# EAGLE design lednode (EAGLE 6.5.0)
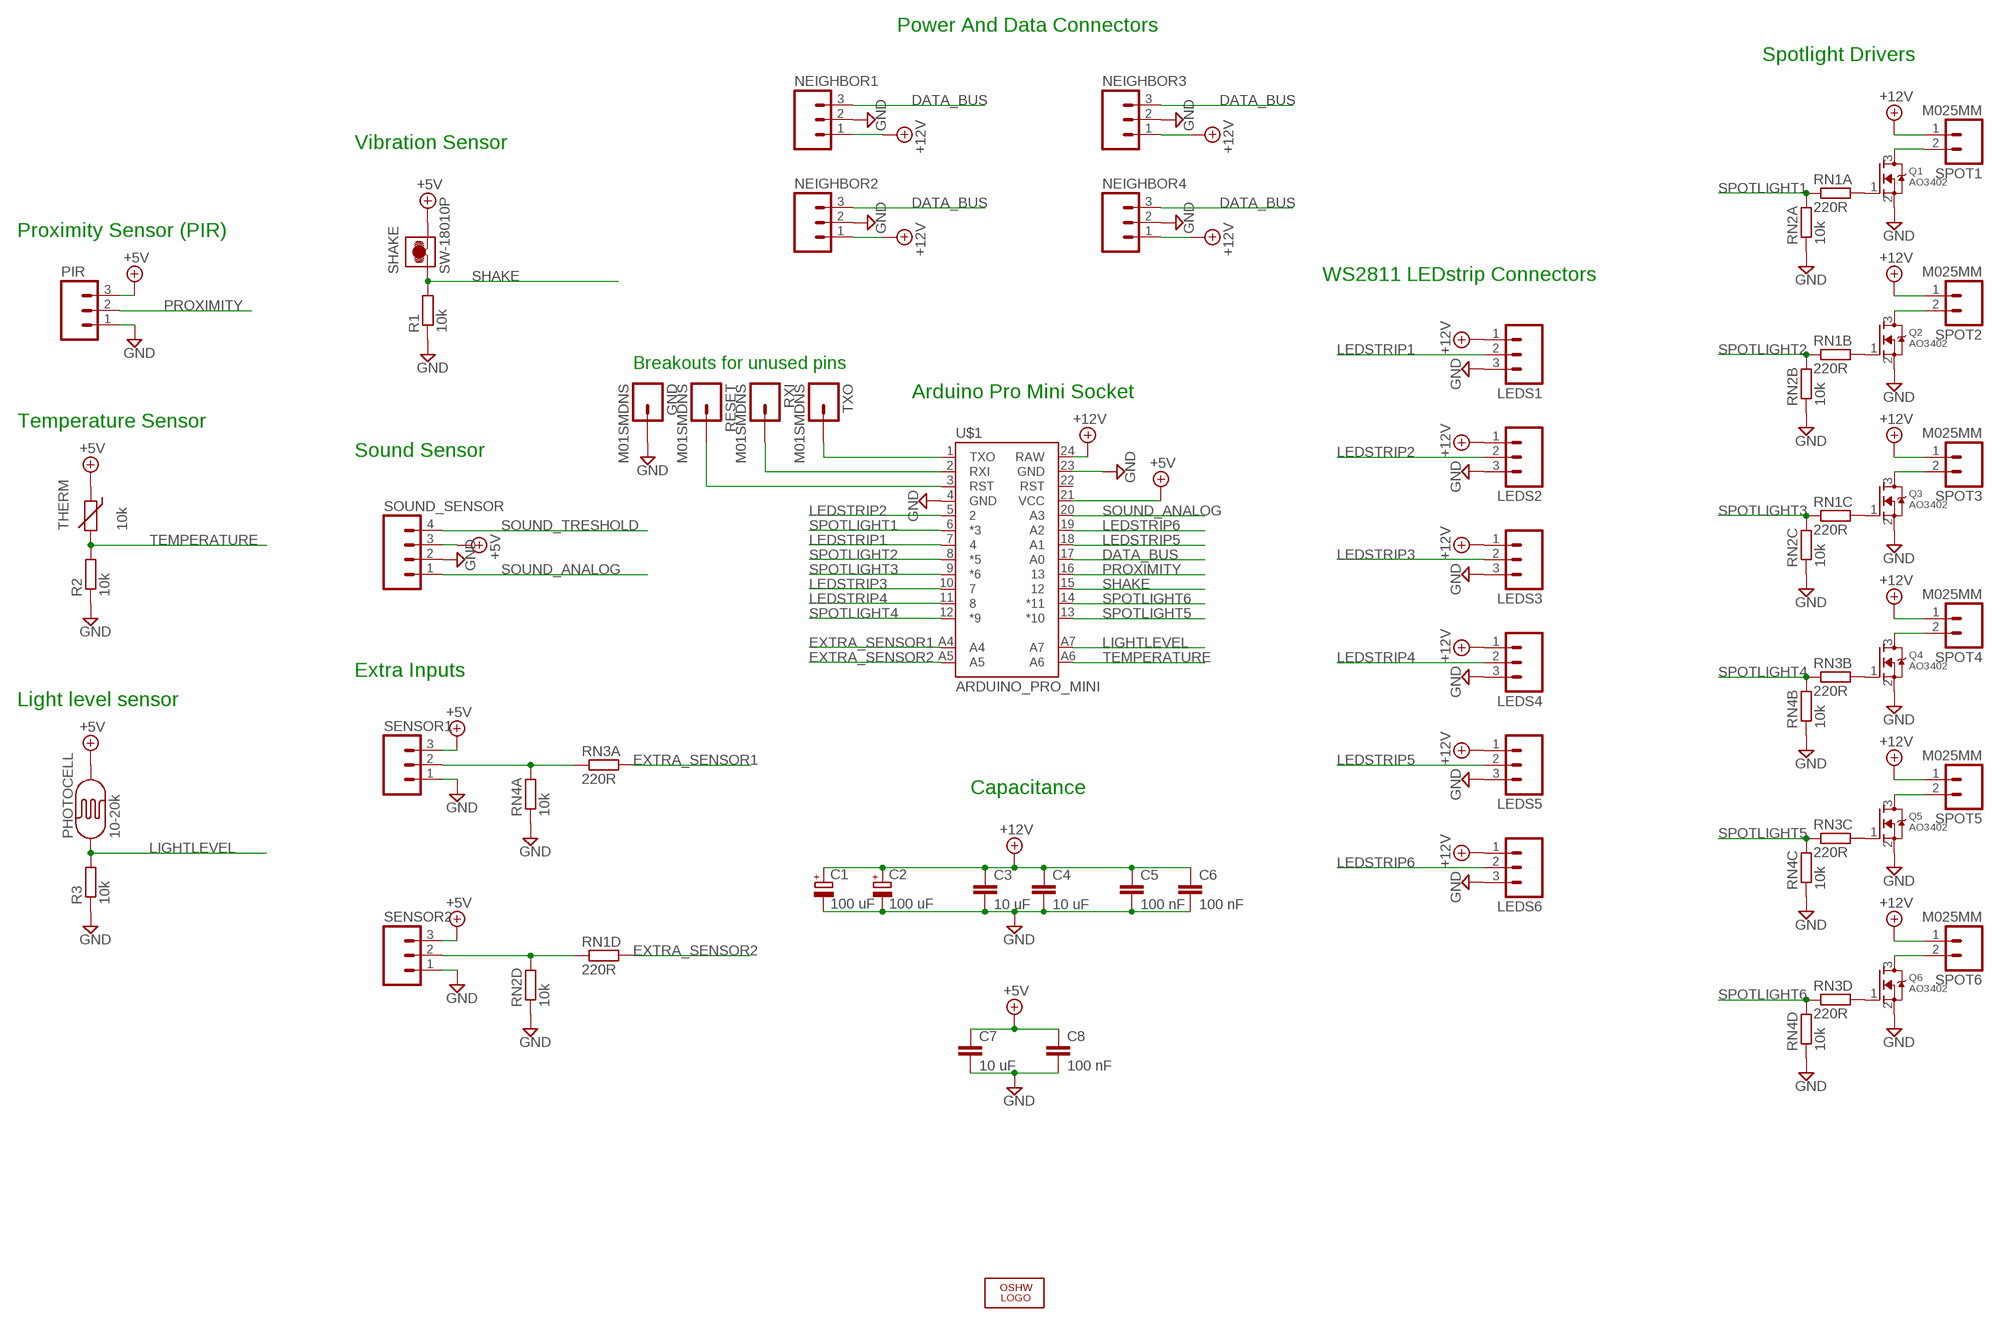
[diagram p0: schematic, sheet 1]

## Parts
C1  100 uF  CPOL-EUE3.5-10  [E3,5-10]
C2  100 uF  CPOL-EUE3.5-10  [E3,5-10]
C3  10 uF  C-EUC1206  [C1206]
C4  10 uF  C-EUC1206  [C1206]
C5  100 nF  C-EUC0805  [C0805]
C6  100 nF  C-EUC0805  [C0805]
C7  10 uF  C-EUC1206  [C1206]
C8  100 nF  C-EUC0805  [C0805]
GND  M01SMDNS  [1X01NS]
LEDS1  M03LONGPADS  [1X03_LONGPADS]
LEDS2  M03LONGPADS  [1X03_LONGPADS]
LEDS3  M03LONGPADS  [1X03_LONGPADS]
LEDS4  M03LONGPADS  [1X03_LONGPADS]
LEDS5  M03LONGPADS  [1X03_LONGPADS]
LEDS6  M03LONGPADS  [1X03_LONGPADS]
LOGO3  LOGO-OSHW-8MILX0100-NT  [OSHW_8X100_NOTEXT]
NEIGHBOR1  M03-SCREW-5MM  [SCREWTERMINAL-5MM-3]
NEIGHBOR2  M03-SCREW-5MM  [SCREWTERMINAL-5MM-3]
NEIGHBOR3  M03-SCREW-5MM  [SCREWTERMINAL-5MM-3]
NEIGHBOR4  M03-SCREW-5MM  [SCREWTERMINAL-5MM-3]
PHOTOCELL  10-20k  PHOTOCELLPTH  [PHOTOCELL]
PIR  M03PTH  [1X03]
Q1  AO3402  MOSFET-NWAVE  [SOT23-W]
Q2  AO3402  MOSFET-NWAVE  [SOT23-W]
Q3  AO3402  MOSFET-NWAVE  [SOT23-W]
Q4  AO3402  MOSFET-NWAVE  [SOT23-W]
Q5  AO3402  MOSFET-NWAVE  [SOT23-W]
Q6  AO3402  MOSFET-NWAVE  [SOT23-W]
R1  10k  R-EU_R0805  [R0805]
R2  10k  R-EU_R0805  [R0805]
R3  10k  R-EU_R0805  [R0805]
RESET  M01SMDNS  [1X01NS]
RN1  220R  RESISTOR_ARRAY_4  [RN8P-4R-CRA06S]
RN2  10k  RESISTOR_ARRAY_4  [RN8P-4R-CRA06S]
RN3  220R  RESISTOR_ARRAY_4  [RN8P-4R-CRA06S]
RN4  10k  RESISTOR_ARRAY_4  [RN8P-4R-CRA06S]
RXI  M01SMDNS  [1X01NS]
SENSOR1  M03PTH  [1X03]
SENSOR2  M03PTH  [1X03]
SHAKE  SW-18010P  CM4400  [CM4400]
SOUND_SENSOR  M041X04_NO_SILK  [1X04_NO_SILK]
SPOT1  M025MM  [SCREWTERMINAL-5MM-2]
SPOT2  M025MM  [SCREWTERMINAL-5MM-2]
SPOT3  M025MM  [SCREWTERMINAL-5MM-2]
SPOT4  M025MM  [SCREWTERMINAL-5MM-2]
SPOT5  M025MM  [SCREWTERMINAL-5MM-2]
SPOT6  M025MM  [SCREWTERMINAL-5MM-2]
THERM  10k  THERMISTOR_R-7,5  [R-7,5]
TXO  M01SMDNS  [1X01NS]
U$1  ARDUINO_PRO_MINI  [ARDUINO_PRO_MINI]

## Nets
+5V: C7.1 C8.1 PHOTOCELL.2 PIR.3 SENSOR1.3 SENSOR2.3 SHAKE.2 SOUND_SENSOR.3 THERM.1 U$1.21(VCC)
+12V: C1.+ C2.+ C3.1 C4.1 C5.1 C6.1 LEDS1.1 LEDS2.1 LEDS3.1 LEDS4.1 LEDS5.1 LEDS6.1 NEIGHBOR1.1 NEIGHBOR2.1 NEIGHBOR3.1 NEIGHBOR4.1 SPOT1.1 SPOT2.1 SPOT3.1 SPOT4.1 SPOT5.1 SPOT6.1 U$1.24(RAW)
DATA_BUS: NEIGHBOR1.3 NEIGHBOR2.3 NEIGHBOR3.3 NEIGHBOR4.3 U$1.17(A0)
EXTRA_SENSOR1: RN3.8 U$1.A4
EXTRA_SENSOR2: RN1.5 U$1.A5
GND: C1.- C2.- C3.2 C4.2 C5.2 C6.2 C7.2 C8.2 GND.1 LEDS1.3 LEDS2.3 LEDS3.3 LEDS4.3 LEDS5.3 LEDS6.3 NEIGHBOR1.2 NEIGHBOR2.2 NEIGHBOR3.2 NEIGHBOR4.2 PIR.1 Q1.2(S) Q2.2(S) Q3.2(S) Q4.2(S) Q5.2(S) Q6.2(S) R1.1 R2.1 R3.1 RN2.1 RN2.2 RN2.3 RN2.4 RN4.1 RN4.2 RN4.3 RN4.4 SENSOR1.1 SENSOR2.1 SOUND_SENSOR.2 U$1.4(GND) U$1.23(GND)
LEDSTRIP1: LEDS1.2 U$1.7
LEDSTRIP2: LEDS2.2 U$1.5
LEDSTRIP3: LEDS3.2 U$1.10
LEDSTRIP4: LEDS4.2 U$1.11
LEDSTRIP5: LEDS5.2 U$1.18(A1)
LEDSTRIP6: LEDS6.2 U$1.19(A2)
LIGHTLEVEL: PHOTOCELL.1 R3.2 U$1.A7
N$1: Q5.3(D) SPOT5.2
N$2: Q1.3(D) SPOT1.2
N$3: Q2.3(D) SPOT2.2
N$4: Q4.3(D) SPOT4.2
N$5: Q3.3(D) SPOT3.2
N$6: Q1.1(G) RN1.8
N$7: Q2.1(G) RN1.7
N$8: Q4.1(G) RN3.7
N$9: Q3.1(G) RN1.6
N$10: Q5.1(G) RN3.6
N$11: Q6.3(D) SPOT6.2
N$12: Q6.1(G) RN3.5
N$13: RN1.4 RN2.5 SENSOR2.2
N$14: TXO.1 U$1.1(TXO)
N$15: RXI.1 U$1.2(RXI)
N$16: RESET.1 U$1.3(RST)
PROXIMITY: PIR.2 U$1.16
SENSOR1: RN3.1 RN4.8 SENSOR1.2
SHAKE: R1.2 SHAKE.1 U$1.15
SOUND_ANALOG: SOUND_SENSOR.1 U$1.20(A3)
SOUND_TRESHOLD: SOUND_SENSOR.4
SPOTLIGHT1: RN1.1 RN2.8 U$1.6(*3)
SPOTLIGHT2: RN1.2 RN2.7 U$1.8(*5)
SPOTLIGHT3: RN1.3 RN2.6 U$1.9(*6)
SPOTLIGHT4: RN3.2 RN4.7 U$1.12(*9)
SPOTLIGHT5: RN3.3 RN4.6 U$1.13(*10)
SPOTLIGHT6: RN3.4 RN4.5 U$1.14(*11)
TEMPERATURE: R2.2 THERM.2 U$1.A6
Unconnected: U$1.22(RST)

## Notes on the sheet
- Power And Data Connectors
- Spotlight Drivers
- Vibration Sensor
- Proximity Sensor (PIR)
- WS2811 LEDstrip Connectors
- Breakouts for unused pins
- Arduino Pro Mini Socket
- Temperature Sensor
- Sound Sensor
- Extra Inputs
- Light level sensor
- Capacitance

## Library data of the parts
C1 C2 = rcl:CPOL-EU: POLARIZED CAPACITOR, European symbol
C3-C8 = rcl:C-EU: CAPACITOR, European symbol
GND RESET RXI TXO = SparkFun-Connectors:M01: Header 1 Standard 1-pin 0.1" header. Use with straight break away headers (SKU : PRT-00116), right angle break away headers (PRT-00553), swiss pins (PRT-00743), machine pins (PRT-00117), and female headers (PRT-00115).
LEDS1-LEDS6 NEIGHBOR1-NEIGHBOR4 PIR SENSOR1 SENSOR2 = SparkFun-Connectors:M03: Header 3 Standard 3-pin 0.1" header. Use with straight break away headers (SKU : PRT-00116), right angle break away headers (PRT-00553), swiss pins (PRT-00743), machine pins (PRT-00117), and female headers (PRT-00115). Molex polarized connector foot print use with SKU : PRT-08232 with associated crimp pins and housings.
LOGO3 = Logo:LOGO-OSHW-8MIL
PHOTOCELL = SparkFun-Sensors:PHOTOCELL: CdS photoresistor. This is a low cost way to detect light levels. Resistance decreases with more incoming light. SparkFun SKU: SEN-09088
Q1-Q6 = adafruit:MOSFET-N: N-Channel Mosfet 2N7002E - 60V 260mA SOT23 [Digikey: 2N7002ET1GOSTR-ND] - REEL BSH103 - 30V 850mA SOT23 [Digikey: 568-5013-1-ND]
R1-R3 = rcl:R-EU_: RESISTOR, European symbol
RN1-RN4 = dp_devices:RESISTOR_ARRAY_4: 4 Resistor Array 0603
SHAKE = sensor-comus-group:CM4400: MOVEMENT / VIBRATION SWITCH - Mercury Contacts Source: Assemtech Europe Limited, E. Bachem GmbH Comus International, W. Gunther GmbH, Gunther Belgium; MF: FARNELL; MPN: CM4400-1.; OC_FARNELL: 540626; OC_NEWARK: 09WX7014
SOUND_SENSOR = SparkFun-Connectors:M04: Header 4 Standard 4-pin 0.1" header. Use with straight break away headers (SKU : PRT-00116), right angle break away headers (PRT-00553), swiss pins (PRT-00743), machine pins (PRT-00117), and female headers (PRT-00115). Molex polarized connector foot print use with SKU : PRT-08231 with associated crimp pins and housings. 1MM SMD Version SKU: PRT-10208
SPOT1-SPOT6 = SparkFun-Connectors:M02: Standard 2-pin 0.1" header. Use with - straight break away headers ( PRT-00116) - right angle break away headers (PRT-00553) - swiss pins (PRT-00743) - machine pins (PRT-00117) - female headers (PRT-00115) Molex polarized connector foot print use with: PRT-08233 with associated crimp pins and housings. 2.54_SCREWTERM for use with PRT-10571. 3.5mm Screw Terminal footprints for PRT-08084 5mm Screw Terminal footprints for use with PRT-08433
THERM = discrete-fixed-thermistor-silk:THERMISTOR_: Thermo Resistor
U$1 = SparkFun-Boards-with-arduino-pro-mini-without-connection-pins:ARDUINO_PRO_MINI

## Board
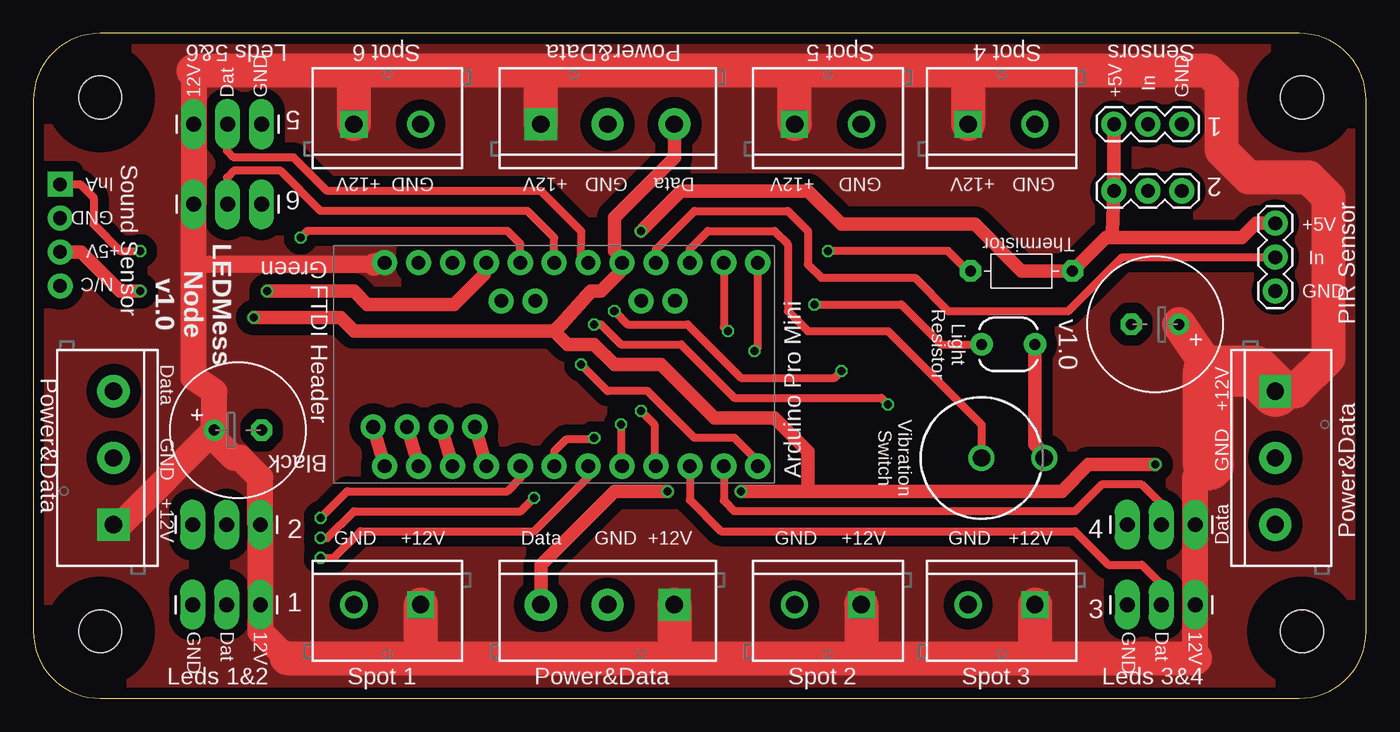
[diagram p1: board, top side]
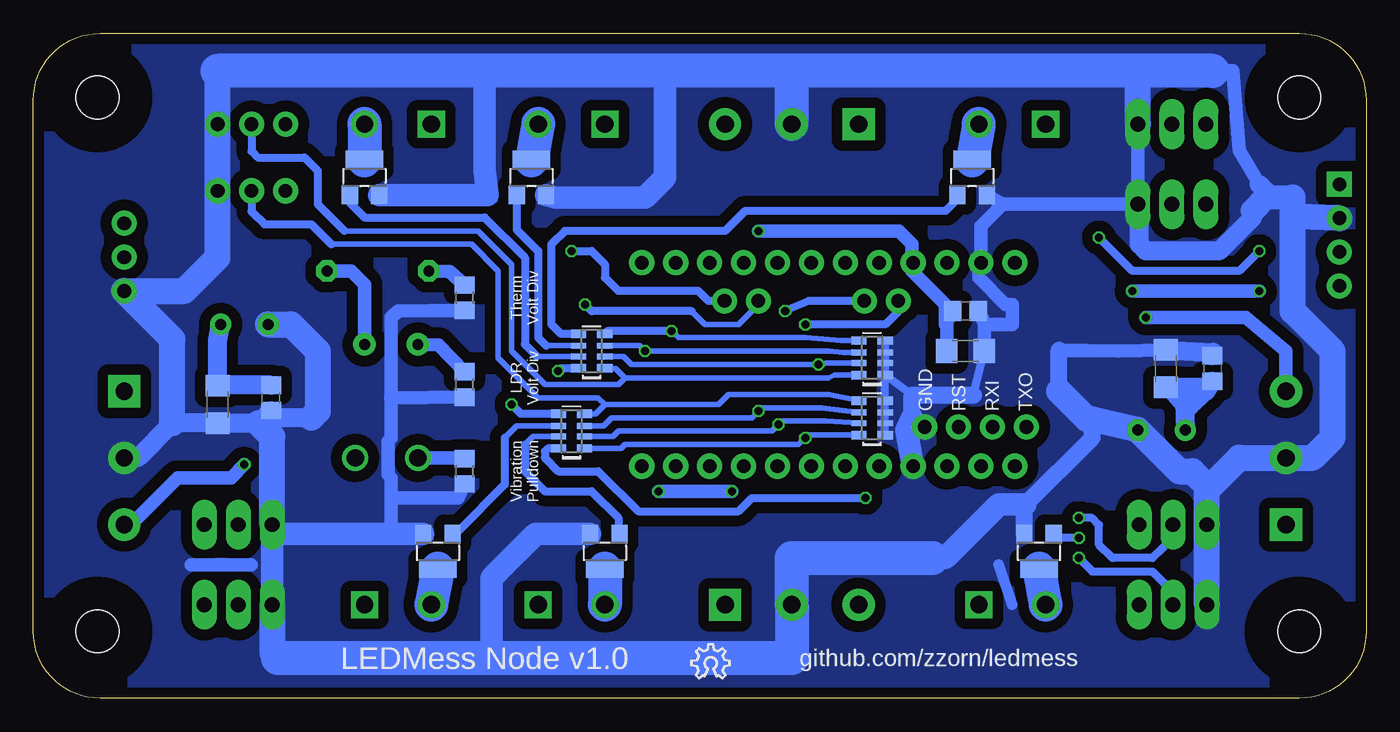
[diagram p2: board, bottom side, seen from below]

Size 99.8 x 49.8 mm. Coordinates in mm from the lower left corner, seen from the top.
Outline: 0,44.8 0,5 arc90 5,0 94.8,0 arc90 99.8,5 99.8,44.8 arc90 94.8,49.8 5,49.8 arc90 0,44.8
Copper layers (1*16): Top 0.035mm / dielectric 1.5mm / Bottom 0.035mm
Design rules "SeeedStudio_2layer_DRU_no_angle_20140221": minimum track width 6mil, minimum drill 12mil, track to track 6mil, track to pad 6mil, pad to pad 6mil, via to via 6mil, smd to smd 0mil, copper to edge 10mil, drill to drill 10mil, minimum pad ring 10mil, minimum via ring 6mil, stop-mask expansion 2mil, vias tented up to drill 100mil, thermal gap 10mil
Holes 3.2 mm at 95,5 95,45 5,45 5,5
tRestrict: area 3,3 to 7,7; area 93,3 to 97,7; area 93,43 to 97,47; area 3,43 to 7,47
bRestrict: area 3,3 to 7,7; area 93,3 to 97,7; area 93,43 to 97,47; area 3,43 to 7,47

### Footprints (pad centres in the part's own frame; a part is rotated, then mirrored left to right if it is on the bottom)
E3,5-10 = drill 0.813 pad 1.6: + -1.778,0 | drill 0.813 pad 1.6 octagon: - 1.778,0
C1206 = smd 1.6 x 1.8: 1 -1.4,0; 2 1.4,0
C0805 = smd 1.3 x 1.5: 1 -0.95,0; 2 0.95,0
1X01NS = drill 1.016 pad 1.88: 1 0,0
1X03_LONGPADS = drill 1.118 pad 1.88 long: 1 0,0; 2 2.54,0; 3 5.08,0
SCREWTERMINAL-5MM-3 = drill 1.3 pad 2.413 square: 1 0,0 | drill 1.3 pad 2.413: 2 5,0; 3 10,0
PHOTOCELL = drill 0.8 pad 1.676: 1 -2,0; 2 2,0
1X03 = drill 1.016 pad 1.88: 1 0,0; 2 2.54,0; 3 5.08,0
SOT23-W = smd 1.2 x 1.4: 1 -1.1,-1.3; 2 1.1,-1.3 | smd 2.8 x 1.4: 3 0,1.3
R0805 = smd 1.3 x 1.5: 1 -0.95,0; 2 0.95,0
RN8P-4R-CRA06S = smd 0.63 x 1.15: 1 -1.295,-0.975; 4 1.295,-0.975; 5 1.295,0.975; 8 -1.295,0.975 | smd 0.44 x 1.15: 2 -0.4,-0.975; 3 0.4,-0.975; 6 0.4,0.975; 7 -0.4,0.975
CM4400 = drill 1.3 pad 1.93: 1 0,0; 2 0,-4.7
1X04_NO_SILK = drill 1.016 pad 1.88 square: 1 0,0 | drill 1.016 pad 1.88: 2 2.54,0; 3 5.08,0; 4 7.62,0
SCREWTERMINAL-5MM-2 = drill 1.3 pad 2.032 square: 1 0,0 | drill 1.3 pad 2.032: 2 5,0
R-7,5 = drill 0.813 pad 1.6 octagon: 1 -3.81,0; 2 3.81,0
ARDUINO_PRO_MINI = drill 1.016 pad 1.88: 1 -7.62,12.7; 2 -7.62,10.16; 3 -7.62,7.62; 4 -7.62,5.08; 5 -7.62,2.54; 6 -7.62,0; 7 -7.62,-2.54; 8 -7.62,-5.08; 9 -7.62,-7.62; 10 -7.62,-10.16; 11 -7.62,-12.7; 12 -7.62,-15.24; 13 7.62,-15.24; 14 7.62,-12.7; 15 7.62,-10.16; 16 7.62,-7.62; 17 7.62,-5.08; 18 7.62,-2.54; 19 7.62,0; 20 7.62,2.54; 21 7.62,5.08; 22 7.62,7.62; 23 7.62,10.16; 24 7.62,12.7; A4 4.763,1.429; A5 4.763,3.969; A6 4.763,-9.049; A7 4.763,-6.509

### Placement (x,y rotation side)
C1  84,28 180 top
C2  15.32,20.08 0 top
C3  15,24.7 90 bottom
C4  86,22 270 bottom
C5  11.5,24.7 90 bottom
C6  82,22.5 270 bottom
C7  30,26 0 bottom
C8  30,29 0 bottom
GND  33.06,20.32 0 top
LEDS1  17,7 180 top
LEDS2  17,13 180 top
LEDS3  87,7 180 top
LEDS4  87,13 180 top
LEDS5  12,43 0 top
LEDS6  12,37 0 top
LOGO3  50.5,1.5 0 bottom
NEIGHBOR1  38,43 0 top
NEIGHBOR2  93,23 270 top
NEIGHBOR3  48,7 180 top
NEIGHBOR4  6,13 90 top
PHOTOCELL  73,26.5 0 top
PIR  93,30.5 90 top
Q1  24.5,11 180 bottom
Q2  57,11 180 bottom
Q3  69.5,11 180 bottom
Q4  75,39 0 bottom
Q5  62.5,39 0 bottom
Q6  29.5,39 0 bottom
R1  67.5,17 90 bottom
R2  67.5,30 90 bottom
R3  67.5,23.5 90 bottom
RESET  30.52,20.32 0 top
RN1  59.5,20 90 bottom
RN2  37,21 90 bottom
RN3  58,26 90 bottom
RN4  37,25.5 90 bottom
RXI  27.98,20.32 0 top
SENSOR1  86,43 180 top
SENSOR2  86,38 180 top
SHAKE  71,18 90 top
SOUND_SENSOR  2,38.5 270 top
SPOT1  29,7 180 top
SPOT2  62,7 180 top
SPOT3  75,7 180 top
SPOT4  70,43 0 top
SPOT5  57,43 0 top
SPOT6  24,43 0 top
THERM  74,32 180 top
TXO  25.44,20.32 0 top
U$1  39,25 90 top

### Tracks (layer width: path | path; a pad name or v marks a point on that pad's centre or on a via)
+5V  (via drill 0.6)
  Top 1.016: v45.5,35 48.5,38 58,38 60.5,35.5 70.5,35.5 74,32 THERM.1 80.31,34.5 80.81,34.5 | SENSOR1.3 SENSOR2.3 80.81,34.89 80.81,34.5 | PIR.3 91.58,35.58 90.5,34.5 80.81,34.5 | SOUND_SENSOR.3 3.58,33.42 6.5,30.5 v8,30.5 | PHOTOCELL.2 75,19 75.5,18.5 75.5,18.2 SHAKE.2 | v17.5,30.5 24,30.5 25,29.5 31.5,29.5 33.75,31.75 33.75,32.45 U$1.21
  Bottom 1.016: v45.5,35 35,35 34,34 34,32.7 U$1.21 34,32.54 34,32 31.5,29.5 31.5,28 C8.1 31.4,29.05 C7.1 | THERM.1 76,32 75,31 PHOTOCELL.2 | v8,30.5 v17.5,30.5
+12V
  Top 1.27: 25.5,32.5 12,32.5
  Top 1.676: U$1.24 26.3,32.7 25.5,32.5
  Top 1.93: 19,3 17,5 LEDS1.1 LEDS2.1 17,16.5 15.5,18 15,18 13.5,19.5 13.5,20 | 87,3 LEDS3.1 LEDS4.1 87,16.5 88,17.5 | 12,47 LEDS5.1 LEDS6.1 12,32.5 12,24 13.54,22.96 C2.+ 13.5,20.84 13.5,20 | NEIGHBOR4.1 6.5,13 13.5,20
  Top 2.54: 19,3 29,3 | 29,3 48,3 | 48,3 62,3 | 62,3 75,3 | 75,3 87,3 | SPOT1.1 29,3 | NEIGHBOR3.1 48,3 | SPOT2.1 62,3 | SPOT3.1 75,3 | SPOT6.1 24,47 | 24,47 12,47 | NEIGHBOR1.1 38,47 | 38,47 24,47 | 70,47 88,47 89,46 89,41 91,39 95.5,39 97,37.5 97,25.5 94.5,23 NEIGHBOR2.1 | 70,47 57,47 | 57,47 38,47 | SPOT5.1 57,47 | SPOT4.1 70,47 | 88,24.5 88,24.78 C1.+
  Top 3.81: 88,17.5 88,24.5 91.5,24.5 NEIGHBOR2.1
  Bottom 1.422: C6.1 85.95,23.45 C4.1 86,26.78 C1.+ | C3.1 11.85,23.3 C5.1 12,23 13.2,21.92 13.5,23.12 14.6,23.12 13.6,22 13.6,22.2 | 13.6,22.8 13.6,22.2 | 13.6,22.2 C2.+
  pour Top (isolate 0.813, no thermals): 0,50 100,50 100,0 0,0
DATA_BUS  (via drill 0.6)
  Top 0.61: U$1.17 44.08,32.08
  Top 1.016: 58,15.5 77,15.5 79,17.5 v84,17.5 | 58,15.5 v53,15.5 | v16.5,28.5 23,28.5 24,27.5 39,27.5 | 44.08,32.08 42.5,30.5 41.75,30.5 39.5,28 39,27.5 | U$1.17 44.08,32.92 43.5,33.5 43.5,36 48,40.5 NEIGHBOR1.3 | NEIGHBOR3.3 38,10 43.5,15.5 v47.5,15.5 | 39,27.5 40,26.5 42,26.5 43.5,25 47,25 51,21 55.5,21 58,18.5 58,15.5
  Bottom 1.016: NEIGHBOR2.3 92.5,13 89,16.5 85,16.5 v84,17.5 | v16.5,28.5 9,28.5 6,26 NEIGHBOR4.3 | v47.5,15.5 v53,15.5
EXTRA_SENSOR1  (via drill 0.6)
  Top 0.61: v60.5,24.5 60,24 53,24 49,28 44.5,28 v43.5,29
  Bottom 0.406: 60.3,24.7 v60.5,24.5
  Bottom 0.61: RN3.8 60.3,24.7 | U$1.A4 41.74,29.76 v43.5,29
EXTRA_SENSOR2  (via drill 0.6)
  Top 0.61: v64,22 63.5,22.5 52.5,22.5 48.5,26.5 44,26.5 42.5,28 v42,28
  Bottom 0.61: RN1.5 63.3,21.3 v64,22 | U$1.A5 35.03,28.97 36,28 v42,28
GND
  Top 1.016: GND.1 U$1.4
  Bottom 0.61: RN4.4 RN4.3 RN4.2 RN4.1 | RN2.1 RN2.2 RN2.3 RN2.4 RN4.1 | RN4.1 34,22.7 | 29.39,22.7 C7.2
  Bottom 0.813: 26.5,7 27.5,10
  Bottom 1.016: 23,26.05 20.95,26.05 18.5,26 C3.2 | LEDS5.3 LEDS6.3 27.2,37 | 27.2,37 Q6.2 | R2.1 70.05,29.05 72.5,29 73,28.5 73,22.5 | 73,22.5 73.05,22.5 R3.1 | R1.1 68,15 73,15 | 73,15 73,16.5 73.25,16.75 73.25,19.25 73,19.5 73,22.5 | 73,15 73,12.3 | 8,38.5 9.5,41 10,47 11.5,47 | 27.2,37 28.84,35.36 U$1.23 29,32.46 29,31.5 27,29.5 26.5,29.5 26.5,28 28.5,28 | C8.2 28.5,28 | C7.2 28.6,27.9 28.5,28 | 83.5,10 88,10
  Bottom 1.27: 29.39,22.7 34,22.7 34,21 | 23,23 23,26.05 | Q1.2 25.6,13.9 25.5,14.5 20.5,19.5 20.5,20.88
  Bottom 1.422: NEIGHBOR2.2 92,18 89.4,20.6 C4.2 82.95,20.6 C6.2 81.45,21 79,21 | C3.2 11.45,25.9 C5.2 | 8.5,36.5 8.5,36 11,33.5 16.5,33.5 17,34 17,37 | 8,38.5 7.5,38
  Bottom 1.676: LEDS4.3 81.92,12.5 | 81.92,12.5 LEDS3.3 | Q2.2 62.2,12.3 65.5,9 65.5,3 | 52.5,47 52.5,39 54,37.5 60.7,37.5 Q5.2 | Q4.2 65.8,37.7 66,39.5 66,47 | Q3.2 73,12.3 81.72,12.3 81.92,12.5 | 32.5,10.5 31.5,10.5 27.5,14.5 25.5,14.5 | U$1.4 34.42,20.08 34,21
  Bottom 1.778: 5.5,37.5 7.5,37.5 8.5,36.5
  Bottom 1.93: LEDS4.3 81.92,19.57 82.95,20.6 | 89.4,20.6 89.4,26.9 PIR.1 88.5,30.5 86,33 SENSOR2.1 SENSOR1.1 86,47 | C1.- 80.5,28 78.5,26 78.5,21.5 79,21 | LEDS1.3 LEDS2.3 11.92,15.58 11.75,15.75 | 11.75,15.75 13,17 14,17 17.1,20.1 C2.- 20.5,20.88 20.88,20.88 23,23 | LEDS3.3 81.92,3.42 81.5,3 | LEDS5.3 17.08,46.58 17.5,47 | 5.5,36 5.5,29 2.5,26 2.5,19.5 4,18 NEIGHBOR4.2 9.5,18 11.75,15.75 | 5.5,36 5.5,37.5 | SOUND_SENSOR.2 5.24,36.06 5.5,36
  Bottom 2.54: 32.5,10.5 43,10.5 NEIGHBOR3.2 43,3 65.5,3 81.5,3 | 43,47 17.5,47 11.5,47 | 43,47 52.5,47 66,47 86,47 | NEIGHBOR1.2 43,47
  pour Bottom (isolate 0.813, no thermals): 0,50 100,50 100,0 0,0
LEDSTRIP1  (via drill 0.6)
  Top 0.61: v21.5,10.5 22.5,10.5 24.5,12.5 37.5,12.5 41.5,16.5 41.5,17.34 U$1.7
  Bottom 0.61: v21.5,10.5 20.5,9.5 16,9.5 14.5,8 14.5,7.04 LEDS1.2
LEDSTRIP2  (via drill 0.6)
  Top 0.61: v21.5,13.5 23.5,15.5 35.5,15.5 36.5,16.5 36.5,17.34 U$1.5
  Bottom 0.61: LEDS2.2 14.46,11.96 16,10.5 19,10.5 20,11.5 20,13 20.5,13.5 v21.5,13.5
LEDSTRIP3
  Top 0.61: U$1.10 49.16,14.84 51.5,12.5 78,12.5 80.5,10 83,10 84.46,8.54 LEDS3.2
LEDSTRIP4
  Top 0.61: LEDS4.2 84.46,14.54 83,16 80,16 78,14 52.5,14 51.7,14.8 U$1.11
LEDSTRIP5
  Top 0.61: U$1.18 41.54,32.46 41,33 41.04,34.96 38,38 22,38 19.5,40.5 15,40.5 14.5,41 14.5,42.96 LEDS5.2
LEDSTRIP6
  Top 0.61: U$1.19 39,34.5 37,36.5 21.5,36.5 18.5,39.5 15,39.5 14.5,39 14.5,37.96 LEDS6.2
LIGHTLEVEL  (via drill 0.6)
  Top 0.61: v58.5,29.5 65,29.5 68,26.5 PHOTOCELL.1
  Bottom 0.406: U$1.A7 45.51,29.49 47,28 49.5,28 50.5,29
  Bottom 0.61: 50.5,29 58,29 v58.5,29.5
  Bottom 1.016: R3.2 69.45,26.45 PHOTOCELL.1
N$1
  Bottom 2.54: SPOT5.2 Q5.3
N$2
  Bottom 2.54: Q1.3 SPOT1.2
N$3
  Bottom 2.54: Q2.3 SPOT2.2
N$4
  Bottom 2.54: SPOT4.2 Q4.3
N$5
  Bottom 2.54: Q3.3 SPOT3.2
N$6  (via drill 0.6)
  Top 0.61: v21.5,12 22,12 24,14 36.5,14 v37.5,15
  Bottom 0.61: RN1.8 61.3,18.7 61.5,18.5 61.5,18 60.5,17 57.5,17 54.5,14 47,14 46,15 v37.5,15 | v21.5,12 23,12 23.5,12.5 Q1.1
N$7
  Bottom 0.406: RN1.7 62.4,19.6 63,19 | 56,12.4 Q2.1
  Bottom 0.61: 63,19 63,17 61.5,15.5 58,15.5 56,13.5 56,12.4
N$8
  Bottom 0.406: Q4.1 76.1,37.1 | RN3.7 62.1,25.6
  Bottom 0.61: 76.1,37.1 75,36 66,36 63,33 63,26.5 62.1,25.6
N$9
  Bottom 0.406: RN1.6 63.6,20.4 64.5,19.5
  Bottom 0.61: 64.5,19.5 64.5,16 68,12.5 Q3.1
N$10
  Bottom 0.406: RN3.6 61.4,26.4
  Bottom 0.61: Q5.1 63.6,35.1 62,33.5 62,27 61.4,26.4
N$11
  Bottom 2.54: SPOT6.2 Q6.3
N$12
  Bottom 0.61: Q6.1 30.5,37.5 31.5,36.5 46.5,36.5 48,35 60,35 61,34 61,28 60.3,27.3 RN3.5
N$13
  Bottom 0.406: RN1.4 57.7,21.3 57,22 | 57,22 48.5,22 47.75,22.75 40.25,22.75 RN2.5 | 77.5,34 67,34 65,32 65,25.5 62,22.5 57.5,22.5 57,22
  Bottom 0.61: SENSOR2.2 83.46,36.46 82.5,35.5 79,35.5 77.5,34
N$14
  Top 1.016: U$1.1 TXO.1
N$15
  Top 1.016: U$1.2 RXI.1
N$16
  Top 1.016: RESET.1 U$1.3
PROXIMITY
  Top 0.61: U$1.16 46.62,33.62 49.5,36.5 56.5,36.5 58,35 58,32.5 59,31.5 66,31.5 68.5,29 77.5,29 81.5,33 92.5,33 93.04,33.04 PIR.2
SENSOR1
  Bottom 0.406: RN4.8 39.8,24.2 40.25,24 55.5,24 | RN3.1 56.2,24.7 55.5,24 | 76.5,35 66.5,35 64,32.5 64,26 61.5,23.5 56,23.5 55.5,24
  Bottom 0.61: SENSOR1.2 83.46,40.96 83,40.5 79.5,40.5 78.5,39.5 78.5,37 76.5,35
SHAKE
  Top 0.61: U$1.15 49.16,33.66 50.5,35 55.5,35 56.5,34 56.5,29 58,27.5 64,27.5 71,20.5 SHAKE.1
  Bottom 1.016: SHAKE.1 68.05,18 R1.2
SOUND_ANALOG  (via drill 0.6)
  Top 0.61: U$1.20 36.46,34.04 35.5,35 20.5,35 v20,34.5 | SOUND_SENSOR.1 3.5,38.5 4.5,37.5 4.5,35.5 6.5,33.5 v8,33.5
  Bottom 0.61: v8,33.5 9.5,32 17.5,32 v20,34.5
SPOTLIGHT1  (via drill 0.6)
  Top 0.406: v42,19.5 42,19.38
  Top 0.61: 42,19.38 39.88,19.38 39,18.5 U$1.6
  Bottom 0.406: RN2.8 41.8,19.7 v42,19.5 42.5,19 55.5,19 55.8,18.7 RN1.1
SPOTLIGHT2  (via drill 0.6)
  Top 0.61: v44,20.5 44,17.46 U$1.8
  Bottom 0.406: RN2.7 40.5,20.75 43.75,20.75 v44,20.5 44.5,20 56,20 56.4,19.6 RN1.2
SPOTLIGHT3  (via drill 0.6)
  Top 0.61: v45.5,21.5 46.5,20.5 46.5,17.5 U$1.9
  Bottom 0.406: RN2.6 40.75,21.75 45.25,21.75 v45.5,21.5 46,21 56.5,21 57.1,20.4 RN1.3
SPOTLIGHT4  (via drill 0.6)
  Top 0.61: U$1.12 54.24,17.76 52.5,19.5 49.5,19.5 46,23 43,23 v41,25
  Bottom 0.406: RN4.7 40.4,25.1 v41,25 55,25 55.6,25.6 RN3.2
SPOTLIGHT5  (via drill 0.6)
  Top 0.61: U$1.13 54.24,26.24 v54,26
  Bottom 0.406: RN3.3 54.4,26.4 v54,26 40.25,26 39.15,25.9 RN4.6
SPOTLIGHT6  (via drill 0.6)
  Top 0.61: U$1.14 51.7,27.8 v52,27.5
  Bottom 0.406: v52,27.5 51.5,27 42,27 39.3,26.8 RN4.5
  Bottom 0.61: v52,27.5 56.82,27.5 RN3.4
TEMPERATURE  (via drill 0.6)
  Top 0.61: THERM.2 69.69,32.31 68.5,33.5 v59.5,33.5
  Bottom 0.61: U$1.A6 49.26,29.76 50,30.5 56,30.5 57,31.5 57,32.5 58,33.5 v59.5,33.5
  Bottom 1.016: R2.2 68.64,31.95 THERM.2

### Text on the board
tSilk: Leds 5&6 | Spot 6 | Power&Data | Spot 5 | Spot 4 | Sensors | In | 12V | Dat | GND | +5V | GND | 5 | 1 | Sound Sensor | InA | +12V | GND | +12V | GND | Data | +12V | GND | +12V | GND | 2 | 6 | GND | +5V | +5V | Thermistor | Green | N/C | In | FTDI Header | LEDMess / Node / v1.0 | GND | PIR Sensor | Light / Resistor | v1.0 | Data | Power&Data | +12V | GND | Black | Vibration / Switch | GND | Arduino Pro Mini | +12V | 2 | GND | +12V | Data | GND | +12V | GND | +12V | GND | +12V | 4 | Data | Power&Data | 1 | 3 | GND | Dat | 12V | GND | Dat | 12V | Leds 1&2 | Spot 1 | Power&Data | Spot 2 | Spot 3 | Leds 3&4
_bsilk: Therm / Volt Div | LDR / Volt Div | TXO | RXI | RST | GND | Vibration / Pulldown | github.com/zzorn/ledmess | LEDMess Node v1.0